# EAGLE design PrimalLogger_Photon (EAGLE 9.5.2)
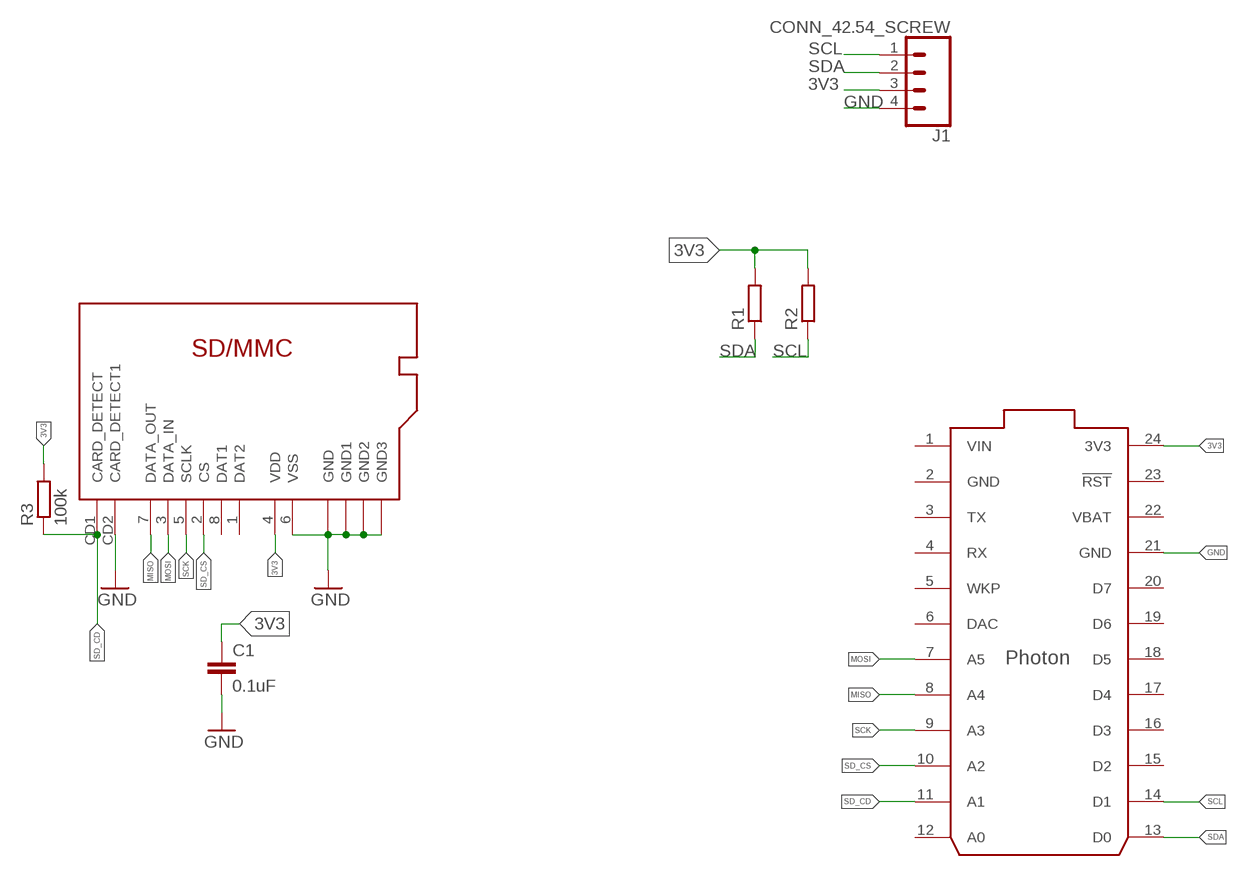
[diagram p0: schematic, sheet 1]

## Parts
C1  0.1uF  C-EU0.1UFC0603  [C0603]
J1  CONN_42.54_SCREW  [1X04_SCREW]
R1  R-EU_10KR0603  [R0603]
R2  R-EU_10KR0603  [R0603]
R3  100k  R-EU_100KR0603  [R0603]
SD1  MICRO_SD  [CUSTOM-PARTS_SD_MICRO]
U$1  PHOTON_NO_SILK  [PHOTON_NO_SILK]

## Nets
3V3: C1.1 J1.3 R1.2 R2.2 R3.2 SD1.4(VDD) U$1.24(3V3)
GND: C1.2 J1.4 SD1.6(VSS) SD1.CD2(CARD_DETECT1) SD1.GND@1(GND) SD1.GND@2(GND1) SD1.GND@3(GND2) SD1.GND@5(GND3) U$1.21(GND)
MISO: SD1.7(DATA_OUT) U$1.8(A4)
MOSI: SD1.3(DATA_IN) U$1.7(A5)
SCK: SD1.5(SCLK) U$1.9(A3)
SCL: J1.1 R2.1 U$1.14(D1)
SD_CD: R3.1 SD1.CD1(CARD_DETECT) U$1.11(A1)
SD_CS: SD1.2(CS) U$1.10(A2)
SDA: J1.2 R1.1 U$1.13(D0)
Unconnected: SD1.1(DAT2) SD1.8(DAT1) U$1.3(TX) U$1.4(RX) U$1.5(WKP) U$1.6(DAC) U$1.12(A0) U$1.15(D2) U$1.16(D3) U$1.17(D4) U$1.18(D5) U$1.19(D6) U$1.20(D7) U$1.23(!RST)

## Power pins joined to a net without a drawn wire
GND: U$1.2(GND)
VBAT: U$1.22(VBAT)
VIN: U$1.1(VIN)

## Library data of the parts
C1 = bschulz_passives:C-EU: CAPACITOR, European symbol; DIGIKEY: 490-6051-1-ND; MF: Murata; MPN: GCM188R71E104KA57D
J1 = bschulz:CONN_4: Genaric 4 terminal header Digikey 2.54_SCREW <https://www.digikey.com/product-detail/en/on-shore-technology-inc/OSTVN04A150/ED10563-ND/1588864>; DIGIKEY: ED10563-ND; MF: On Shore; MPN: OSTVN04A150
R1 R2 = bschulz_passives:R-EU_: RESISTOR, European symbol Digikey Parts: Yageo, 0402 <https://www.digikey.com/products/en/resistors/chip-resistor-surface-mount/52?k=&pkeyword=&sv=0&s=4356&sf=1&FV=-1%7C13%2C7%7C2%2C1291%7C39157%2C1989%7C0%2C-8%7C52%2C3%7C1131%2C3%7C2503&quantity=&ColumnSort=0&page=1&stock=1&pageSize=25> Yageo, 0603 <https://www.digikey.com/products/en/resistors/chip-resistor-surface-mount/52?k=&pkeyword=&sv=0&pv1291=39245&sf=1&FV=-5%7C4356%2C-5%7C47360%2C-8%7C52%2C-1%7C13%2C7%7C2%2C1989%7C0&quantity=10&ColumnSort=1000011&page=1&stock=1&pageSize=25> Panasonic, 0603 <https://www.digikey.com/products/en/resistors/chip-resistor-surface-mount/52?k=&pkeyword=&pv252=68&sf=0&FV=ffec373d%2C1c0002%2C142c040c%2C1f140000%2Cffe00034%2C80002%2Cc0001&quantity=&ColumnSort=0&page=1&stock=1&pageSize=25> Panasonic, precision, 0603 <https://www.digikey.com/products/en/resistors/chip-resistor-surface-mount/52?FV=ffec4907%2Cfffc000a%2Cc0172%2C142c040c%2C1f140000%2Cffe00034%2C1c0002&quantity=100&ColumnSort=2085&page=1&stock=1&pageSize=25> Panasonic, 0805 <https://www.digikey.com/products/en/resistors/chip-resistor-surface-mount/52?k=&pkeyword=&pv3=1&sf=0&FV=ffec373d%2C1c0002%2C1f140000%2Cffe00034%2C142c040d&quantity=&ColumnSort=0&page=1&stock=1&pageSize=25> Rohm, current sense <https://www.digikey.com/products/en/resistors/chip-resistor-surface-mount/52?k=&pkeyword=&pv3=1&sf=0&FV=ffecb688%2C1f140000%2Cffe00034%2C1c0002&quantity=&ColumnSort=0&page=1&stock=1&pageSize=25> Vishay, pulse proof automotive <https://www.digikey.com/products/en/resistors/chip-resistor-surface-mount/52?k=&pkeyword=&pv7=2&sf=0&FV=ffec5d6b%2Cffe00034%2C1f140000&quantity=&ColumnSort=0&page=1&stock=1&pageSize=25>; DIGIKEY: 311-10.0KHRCT-ND; MF: Yageo; MPN: RC0603FR-0710KL; VALUE_PART: 10k
R3 = bschulz_passives:R-EU_: RESISTOR, European symbol Digikey Parts: Yageo, 0402 <https://www.digikey.com/products/en/resistors/chip-resistor-surface-mount/52?k=&pkeyword=&sv=0&s=4356&sf=1&FV=-1%7C13%2C7%7C2%2C1291%7C39157%2C1989%7C0%2C-8%7C52%2C3%7C1131%2C3%7C2503&quantity=&ColumnSort=0&page=1&stock=1&pageSize=25> Yageo, 0603 <https://www.digikey.com/products/en/resistors/chip-resistor-surface-mount/52?k=&pkeyword=&sv=0&pv1291=39245&sf=1&FV=-5%7C4356%2C-5%7C47360%2C-8%7C52%2C-1%7C13%2C7%7C2%2C1989%7C0&quantity=10&ColumnSort=1000011&page=1&stock=1&pageSize=25> Panasonic, 0603 <https://www.digikey.com/products/en/resistors/chip-resistor-surface-mount/52?k=&pkeyword=&pv252=68&sf=0&FV=ffec373d%2C1c0002%2C142c040c%2C1f140000%2Cffe00034%2C80002%2Cc0001&quantity=&ColumnSort=0&page=1&stock=1&pageSize=25> Panasonic, precision, 0603 <https://www.digikey.com/products/en/resistors/chip-resistor-surface-mount/52?FV=ffec4907%2Cfffc000a%2Cc0172%2C142c040c%2C1f140000%2Cffe00034%2C1c0002&quantity=100&ColumnSort=2085&page=1&stock=1&pageSize=25> Panasonic, 0805 <https://www.digikey.com/products/en/resistors/chip-resistor-surface-mount/52?k=&pkeyword=&pv3=1&sf=0&FV=ffec373d%2C1c0002%2C1f140000%2Cffe00034%2C142c040d&quantity=&ColumnSort=0&page=1&stock=1&pageSize=25> Rohm, current sense <https://www.digikey.com/products/en/resistors/chip-resistor-surface-mount/52?k=&pkeyword=&pv3=1&sf=0&FV=ffecb688%2C1f140000%2Cffe00034%2C1c0002&quantity=&ColumnSort=0&page=1&stock=1&pageSize=25> Vishay, pulse proof automotive <https://www.digikey.com/products/en/resistors/chip-resistor-surface-mount/52?k=&pkeyword=&pv7=2&sf=0&FV=ffec5d6b%2Cffe00034%2C1f140000&quantity=&ColumnSort=0&page=1&stock=1&pageSize=25>; DIGIKEY: 311-100KHRCT-ND; MF: Yageo; MPN: RC0603FR-07100KL; VALUE_PART: 100k
SD1 = bschulz:MICRO_SD: Micro SD card holder, Push-Pull, Exposed leads for easy (non-reflow) soldering PN: HR1941CT-ND
U$1 = bschulz:PHOTON: Particle Photon Wi-Fi through-hole development board footprint Product datasheet: here <https://docs.particle.io/datasheets/photon-(wifi)/photon-datasheet/> Design files: here <https://github.com/particle-iot/photon> Github : Particle devices library <https://github.com/particle-iot/hardware-libraries/tree/master/Eagle>

## Board
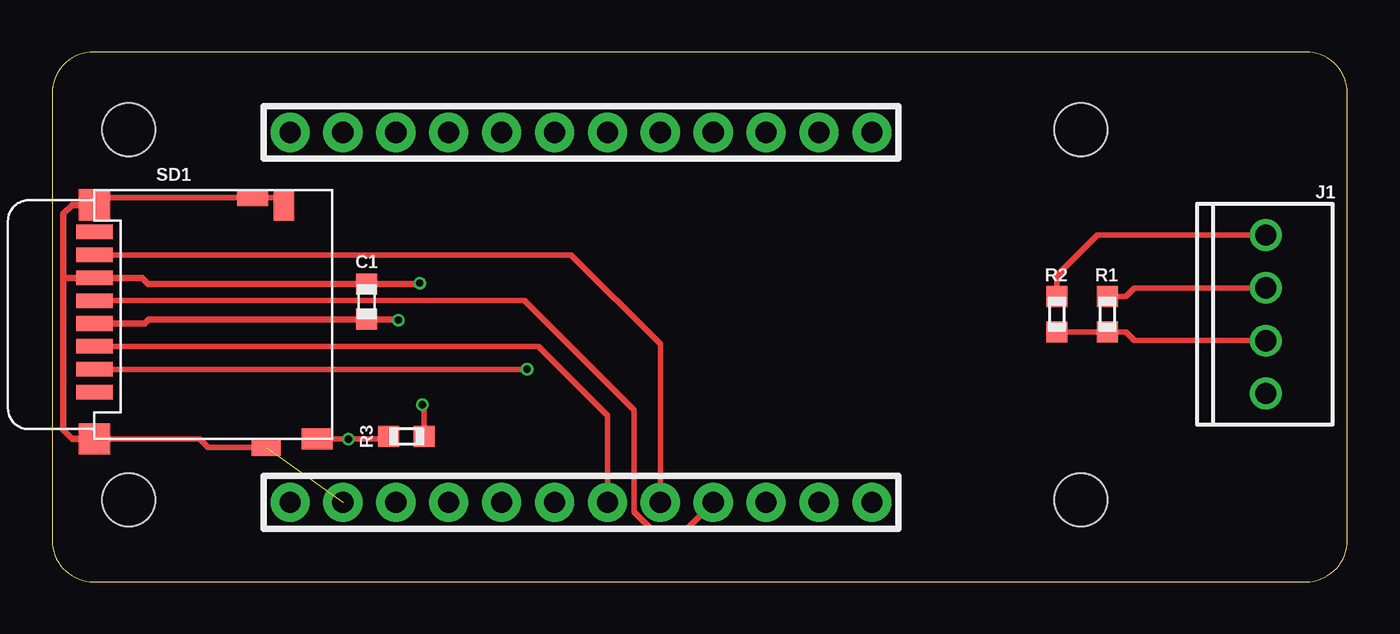
[diagram p1: board, top side]
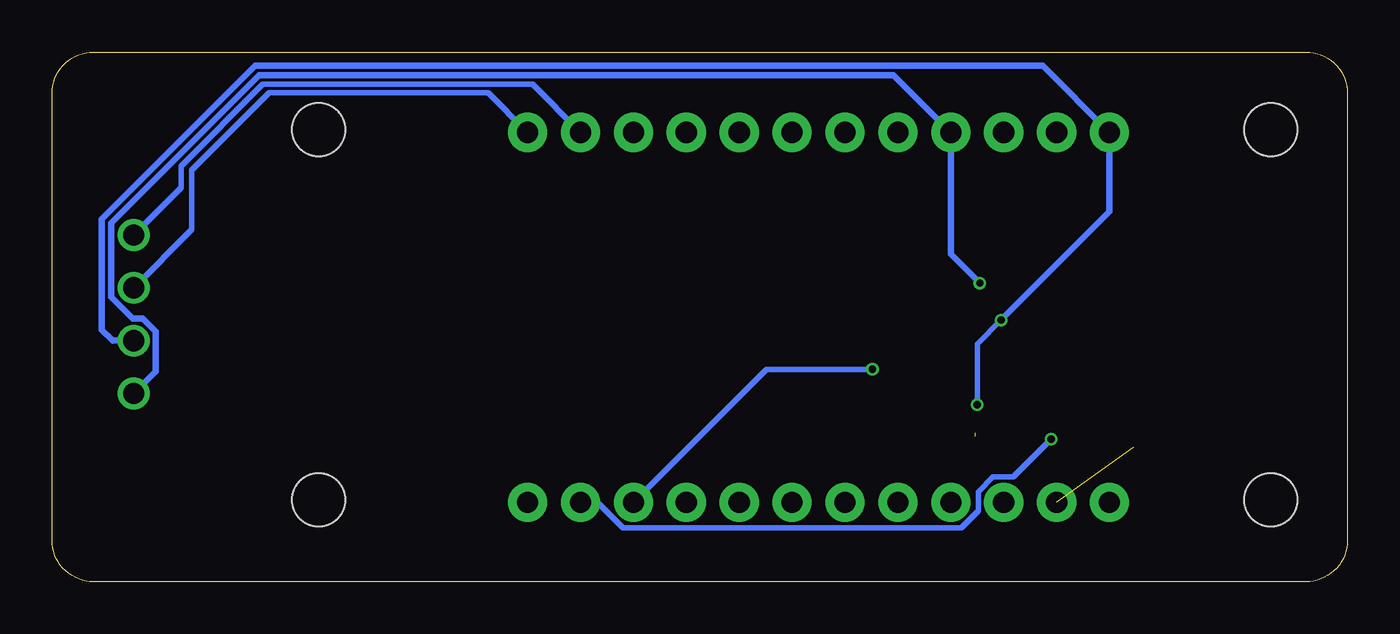
[diagram p2: board, bottom side, seen from below]

Size 62.21 x 25.45 mm. Coordinates in mm from the lower left corner, seen from the top.
Outline: 0,23.45 0,2 arc90 2,0 60.21,0 arc90 62.21,2 62.21,23.45 arc90 60.21,25.45 2,25.45 arc90 0,23.45
Copper layers (1*16): Top 0.035559375mm / dielectric 1.6mm / Bottom 0.035559375mm
Design rules "oshpark-2layer": minimum track width 6mil, minimum drill 10mil, track to track 6mil, track to pad 6mil, pad to pad 6mil, via to via 6mil, smd to smd 6mil, copper to edge 15mil, drill to drill 6mil, minimum pad ring 5mil, minimum via ring 5mil, stop-mask expansion 2.5mil, vias tented up to drill 0mil, thermal gap 10mil
Holes 2.54 mm at 3.68,21.72 3.68,3.94 49.4,3.94 49.4,21.72

### Footprints (pad centres in the part's own frame; a part is rotated, then mirrored left to right if it is on the bottom)
C0603 = smd 1 x 1: 1 -0.85,0; 2 0.85,0
1X04_SCREW = drill 1.016: 1 -3.81,0; 2 -1.27,0; 3 1.27,0; 4 3.81,0
R0603 = smd 1 x 1: 1 -0.85,0; 2 0.85,0
CUSTOM-PARTS_SD_MICRO = smd 0.7 x 1.75: 1 -2.25,0; 2 -3.35,0; 3 -4.45,0; 4 -5.55,0; 5 -6.65,0; 6 -7.75,0; 7 -8.85,0; 8 -9.95,0 | smd 1 x 1.5: CD1 0,10.7 | smd 1.5 x 1: CD2 -11.25,9.1 | smd 1.5 x 1.5: GND@1 0,0; GND@2 -11.25,0 | smd 0.8 x 1.5: GND@3 -11.6,7.6 | smd 0.8 x 1.4: GND@5 0.4,8.25
PHOTON_NO_SILK = drill 1.016 pad 1.88: 1 1.27,33.02; 2 1.27,30.48; 3 1.27,27.94; 4 1.27,25.4; 5 1.27,22.86; 6 1.27,20.32; 7 1.27,17.78; 8 1.27,15.24; 9 1.27,12.7; 10 1.27,10.16; 11 1.27,7.62; 12 1.27,5.08; 13 19.05,5.08; 14 19.05,7.62; 15 19.05,10.16; 16 19.05,12.7; 17 19.05,15.24; 18 19.05,17.78; 19 19.05,20.32; 20 19.05,22.86; 21 19.05,25.4; 22 19.05,27.94; 23 19.05,30.48; 24 19.05,33.02

### Placement (x,y rotation side)
C1  15.11,13.46 90 top
J1  58.29,12.85 270 top
R1  50.67,12.85 270 top
R2  48.26,12.85 270 top
R3  17.02,6.99 0 top
SD1  2.03,6.86 270 top
U$1  44.45,2.54 90 top

### Tracks (layer width: path | path; a pad name or v marks a point on that pad's centre or on a via)
3V3  (via drill 0.35)  (1 unrouted)
  Top 0.254: J1.3 51.98,11.58 51.56,12 R1.2 R2.2 | 17.87,7.15 17.78,7.24 | v17.78,8.51 17.87,8.42 R3.2
  Top 0.305: SD1.4 4.45,12.41 4.65,12.61 C1.1 16.6,12.61 v16.64,12.57
  Bottom 0.254: v16.64,12.57 17.78,11.43 v17.78,8.51
  Bottom 0.305: v16.64,12.57 11.43,17.78 U$1.24 14.63,24.79 52.45,24.79 59.82,17.43 59.82,12.09 59.3,11.58 J1.3
GND  (via drill 0.35)  (1 unrouted)
  Top 0.254: SD1.GND@1 7.09,6.86 7.49,6.46 SD1.GND@5 | SD1.GND@2 2.38,18.46 SD1.GND@3 10.78,18.46 SD1.CD2
  Top 0.305: SD1.GND@1 0.97,6.86 0.53,7.3 0.53,14.61 | SD1.GND@2 0.96,18.11 0.53,17.68 0.53,14.61 | SD1.6 | SD1.6 0.53,14.61 | SD1.6 4.32,14.61 4.61,14.31 C1.2 17.61,14.31 v17.65,14.35
  Bottom 0.305: v17.65,14.35 19.05,15.75 U$1.21 21.79,24.33 52.27,24.33 59.36,17.24 59.36,13.68 58.33,12.65 57.85,12.65 57.23,12.02 57.23,10.11 J1.4
MISO
  Top 0.254: SD1.7 24.93,15.71 29.21,11.43 U$1.8
MOSI
  Top 0.254: SD1.3 23.36,11.31 26.67,8 U$1.7
SCK
  Top 0.254: SD1.5 22.69,13.51 27.94,8.26 27.94,3.36 28.7,2.59 30.53,2.59 U$1.9
SCL
  Top 0.254: R2.1 48.26,14.72 50.2,16.66 J1.1
  Bottom 0.254: J1.1 56.01,18.95 56.01,19.98 52.09,23.9 39.14,23.9 U$1.14
SD_CD  (via drill 0.35)
  Top 0.254: SD1.CD1 v14.22,6.86 16.04,6.86 R3.1
  Bottom 0.254: v14.22,6.86 16.05,5.03 17.02,5.03 17.73,4.32 17.73,3.41 18.55,2.59 34.8,2.59 36.01,3.81 U$1.11
SD_CS  (via drill 0.35)
  Top 0.254: SD1.2 v22.81,10.21
  Bottom 0.254: U$1.10 27.89,10.21 v22.81,10.21
SDA
  Top 0.254: R1.1 51.56,13.7 51.98,14.12 J1.2
  Bottom 0.254: J1.2 55.5,16.92 55.5,19.79 51.79,23.5 41.27,23.5 U$1.13

### Text on the board
tDocu: Primal / Log / Photon | SCL | SDA | 3v3 | GND | Bobby / Schulz / v0.0